# EAGLE design morse_lora_v2 (EAGLE 9.6.2)
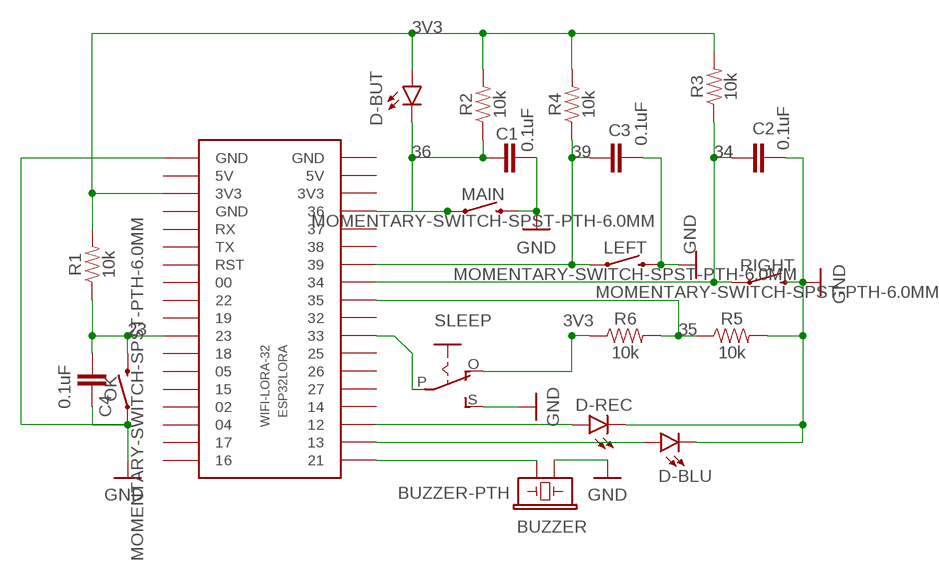
[diagram p0: schematic, sheet 1]

## Parts
BUZZER  BUZZER-PTH  [BUZZER-12MM]
C1  0.1uF  0.1UF-KIT-EZ-50V-20%  [CAP-PTH-SMALL-KIT]
C2  0.1uF  0.1UF-KIT-EZ-50V-20%  [CAP-PTH-SMALL-KIT]
C3  0.1uF  0.1UF-KIT-EZ-50V-20%  [CAP-PTH-SMALL-KIT]
C4  0.1uF  0.1UF-KIT-EZ-50V-20%  [CAP-PTH-SMALL-KIT]
D-BLU  LED5MM  [LED_5MM]
D-BUT  LED5MM  [LED_5MM]
D-REC  LED5MM  [LED_5MM]
ESP32LORA  WIFI-LORA-32  [2.54MM_2X18]
LEFT  MOMENTARY-SWITCH-SPST-PTH-6.0MM  [TACTILE_SWITCH_PTH_6.0MM]
MAIN  MOMENTARY-SWITCH-SPST-PTH-6.0MM  [TACTILE_SWITCH_PTH_6.0MM]
OK  MOMENTARY-SWITCH-SPST-PTH-6.0MM  [TACTILE_SWITCH_PTH_6.0MM]
R1  10k  10KOHM-HORIZ_KIT-1/4W-1%  [AXIAL-0.3-KIT]
R2  10k  10KOHM-HORIZ_KIT-1/4W-1%  [AXIAL-0.3-KIT]
R3  10k  10KOHM-HORIZ_KIT-1/4W-1%  [AXIAL-0.3-KIT]
R4  10k  10KOHM-HORIZ_KIT-1/4W-1%  [AXIAL-0.3-KIT]
R5  10k  10KOHM-HORIZ_KIT-1/4W-1%  [AXIAL-0.3-KIT]
R6  10k  10KOHM-HORIZ_KIT-1/4W-1%  [AXIAL-0.3-KIT]
RIGHT  MOMENTARY-SWITCH-SPST-PTH-6.0MM  [TACTILE_SWITCH_PTH_6.0MM]
SLEEP  EG1218S  [EG1218]

## Nets
3V3: D-BUT.A ESP32LORA.P$3(3V3) R1.P$2 R2.P$2 R3.P$2 R4.P$2 R6.P$1 SLEEP.O
23: C4.2 ESP32LORA.P$11 OK.3 R1.P$1
34: C2.2 ESP32LORA.P$29 R3.P$1 RIGHT.1
35: ESP32LORA.P$28 R5.P$1 R6.P$2
36: C1.2 D-BUT.K(C) ESP32LORA.P$33 MAIN.1 R2.P$1
39: C3.1 ESP32LORA.P$30 LEFT.1 R4.P$1
GND: BUZZER.- C1.1 C2.1 C3.2 C4.1 D-BLU.K(C) D-REC.K(C) ESP32LORA.P$1(GND) LEFT.3 MAIN.3 OK.1 R5.P$2 RIGHT.3 SLEEP.S
N$4: BUZZER.+ ESP32LORA.P$19
N$5: D-REC.A ESP32LORA.P$21
N$6: D-BLU.A ESP32LORA.P$20
N$13: ESP32LORA.P$26 SLEEP.P
Unconnected: ESP32LORA.P$2(5V) ESP32LORA.P$4(GND) ESP32LORA.P$5(RX) ESP32LORA.P$6(TX) ESP32LORA.P$7(RST) ESP32LORA.P$8 ESP32LORA.P$9 ESP32LORA.P$10 ESP32LORA.P$12 ESP32LORA.P$13 ESP32LORA.P$14 ESP32LORA.P$15 ESP32LORA.P$16 ESP32LORA.P$17 ESP32LORA.P$18 ESP32LORA.P$22 ESP32LORA.P$23 ESP32LORA.P$24 ESP32LORA.P$25 ESP32LORA.P$27 ESP32LORA.P$31 ESP32LORA.P$32 ESP32LORA.P$34(3V3) ESP32LORA.P$35(5V) ESP32LORA.P$36(GND)

## Library data of the parts
BUZZER = SparkFun-Electromechanical:BUZZER: Buzzer Small round buzzers that operate around the audible 2kHz range. You can use these as speakers to create simple music or user interfaces. Variant Overview: PTH - Mini Speaker - PC Mount 12mm 2.048kHz <https://www.sparkfun.com/products/7950> PTH_KIT - Mini Speaker - PC Mount 12mm 2.048kHz <https://www.sparkfun.com/products/7950> KIT simplifies soldering by adding stop mask to one side of the pads. PTH_NO_SILK - Mini Speaker - PC Mount 12mm 2.048kHz <https://www.sparkfun.com/products/7950> No silkscreen indicator of buzzer outline. PTH_KIT_NO_SILK - Mini Speaker - PC Mount 12mm 2.048kHz <https://www.sparkfun.com/products/7950> KIT package w/o silkscreen SMD - Buzzer Audio Magnetic (CCV-084B16) SMD buzzer used on, e.g. the LilyPad Buzzer <https://www.sparkfun.com/products/8463> and RFID USB Reader <https://www.sparkfun.com/products/9963>. SMD_KIT - Buzzer Audio Magnetic (CCV-084B16) SMD Buzzer with elongated pins to make soldering easier. Used on the SparkFun Simon Says - Surface Mount Soldering Kit <https://www.sparkfun.com/products/10935>.; PROD_ID: COMP-08253; SF_SKU: COM-07950
C1-C4 = SparkFun-Capacitors:0.1UF: 0.1µF ceramic capacitors A capacitor is a passive two-terminal electrical component used to store electrical energy temporarily in an electric field.; PROD_ID: CAP-08370
D-BLU D-BUT D-REC = SparkFun-LED:LED: LED (Generic) Standard schematic elements and footprints for 5mm, 3mm, 1206, and 0603 sized LEDs. Generic LEDs with no color specified.
ESP32LORA = ESP32_modules:WIFI-LORA-32
LEFT MAIN OK RIGHT = SparkFun-Switches:MOMENTARY-SWITCH-SPST: Momentary Switch (Pushbutton) - SPST Normally-open (NO) SPST momentary switches (buttons, pushbuttons). Variants PTH-12MM - 12mm square, through-hole Momentary Pushbutton Switch - 12mm Square <https://www.sparkfun.com/products/9190> (COM-09190) PTH-6.0MM, PTH-6.0MM-KIT - 6.0mm square, through-hole Mini Pushbutton Switch <https://www.sparkfun.com/products/97> (COM-00097) KIT package intended for soldering kit's - only one side of pads' copper is exposed. PTH-RIGHT-ANGLE-KIT - Right-angle, through-hole Right Angle Tactile Button <https://www.sparkfun.com/products/10791> - Used on SparkFun BigTime Watch Kit <https://www.sparkfun.com/products/11734> SMD-12MM - 12mm square, surface-mount Tactile Button - SMD (12mm) <https://www.sparkfun.com/products/12993> (COM-12993) Used on SparkFun PicoBoard <https://www.sparkfun.com/products/11888> SMD-4.5MM - 4.5mm Square Trackball Switch Used on SparkFun Blackberry Trackballer Breakout <https://www.sparkfun.com/products/13169> SMD-4.6MMX2.8MM - 4.60mm x 2.80mm, surface mount Used on SparkFun SAMD21 Mini Breakout <https://www.sparkfun.com/products/13664> SMD-5.2MM, SMD-5.2-REDUNDANT - 5.2mm square, surface-mount Mini Pushbutton Switch - SMD <https://www.sparkfun.com/products/8720> (COM-08720) Used on Arduino Pro Mini <https://www.sparkfun.com/products/11114> REDUNDANT package connects both switch circuits together SMD-6.0X3.5MM - 6.0 x 3.5mm, surface mount Momentary Reset Switch SMD <https://www.sparkfun.com/products/8229> (COM-08229) SMD-6.2MM-TALL - 6.2mm square, surface mount Tactile Button - SMD (6mm) <https://www.sparkfun.com/products/12992> Used on SparkFun Digital Sandbox <https://www.sparkfun.com/products/12651> SMD-RIGHT-ANGLE - Right-angle, surface mount Used on SparkFun Block for Intel® Edison - Arduino <https://www.sparkfun.com/products/13036>; PROD_ID: SWCH-08441; SF_SKU: COM-00097
R1-R6 = SparkFun-Resistors:10KOHM: 10kΩ resistor A resistor is a passive two-terminal electrical component that implements electrical resistance as a circuit element. Resistors act to reduce current flow, and, at the same time, act to lower voltage levels within circuits. - Wikipedia; PROD_ID: RES-12183
SLEEP = adafruit:EG1218: SLIDING SWITCH 0.1" spacing through hole, vertical SPDT slide switch http://www.ladyada.net/library/pcb/eaglelibrary.html

## Board
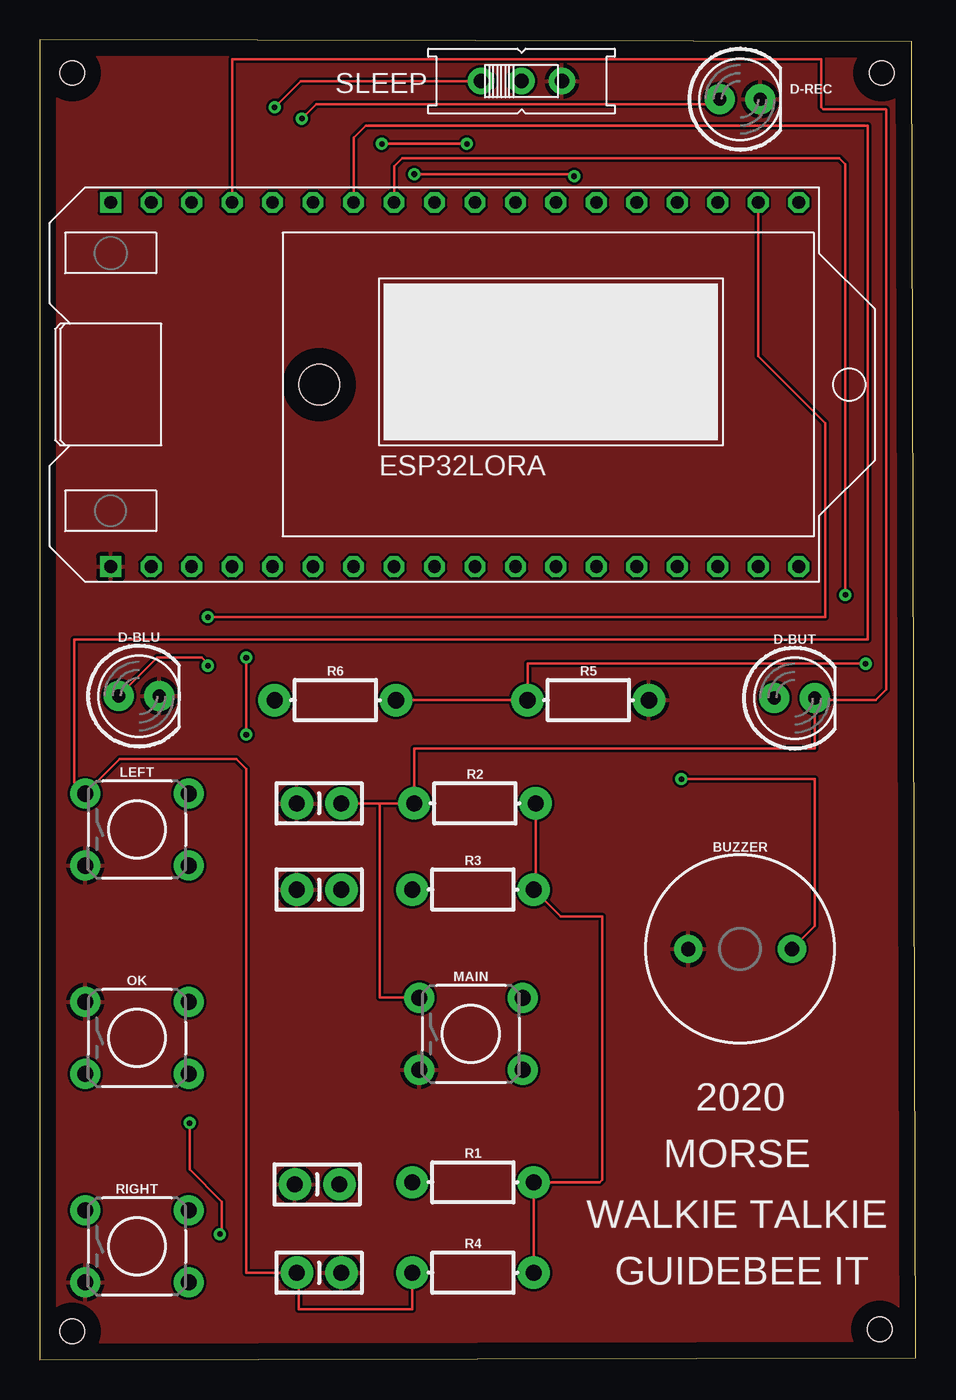
[diagram p1: board, top side]
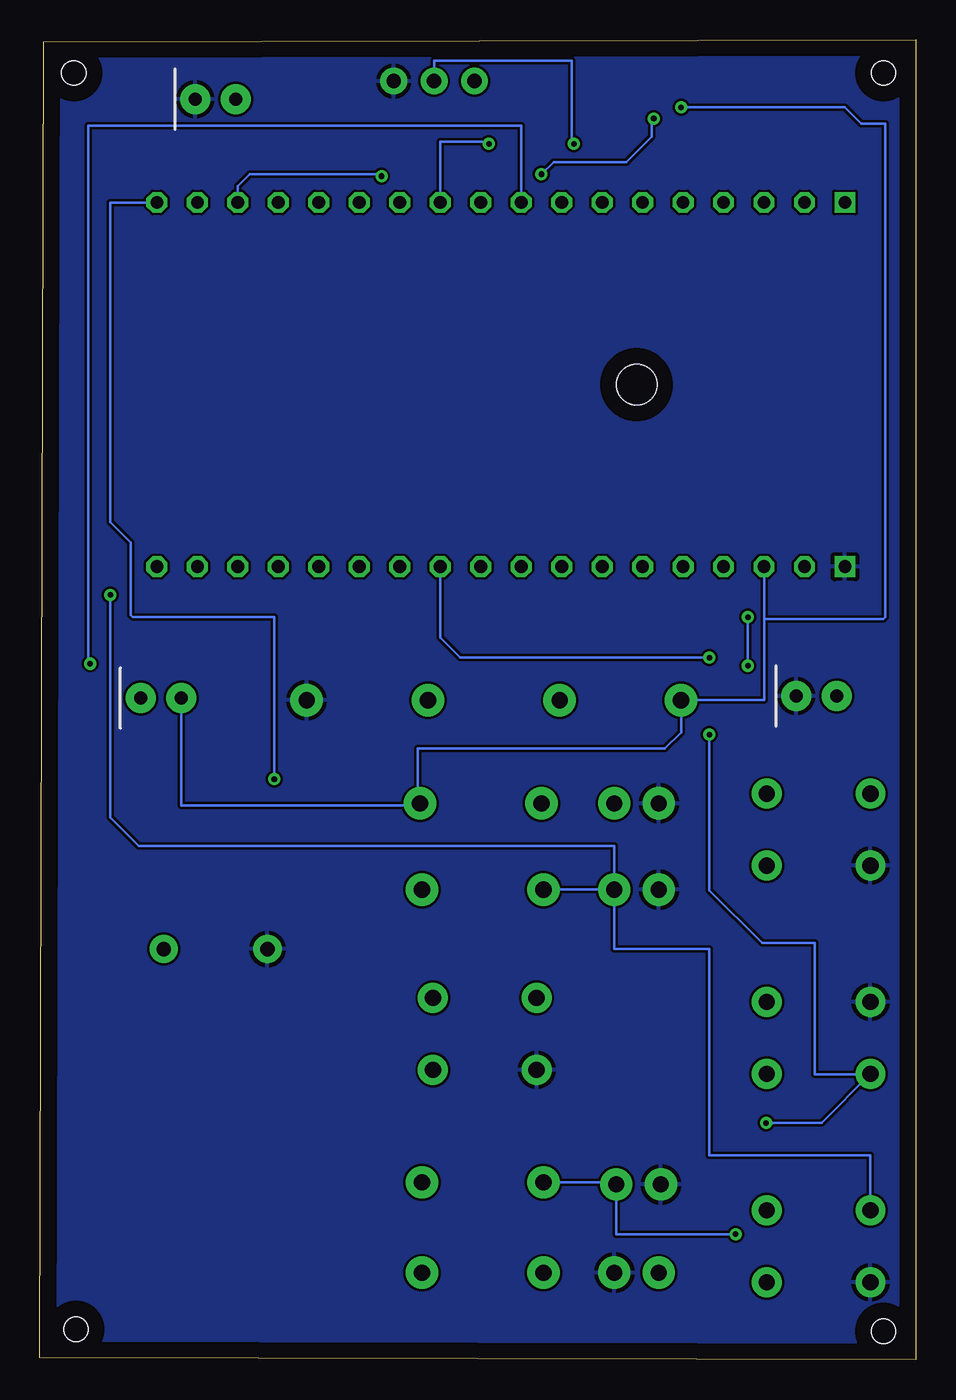
[diagram p2: board, bottom side, seen from below]

Size 54.97 x 82.86 mm. Coordinates in mm from the lower left corner, seen from the top.
Outline: 0,0 54.97,0.13 54.72,82.73 0,82.86 0,0
Copper layers (1*16): Top 0.035mm / dielectric 1.5mm / Bottom 0.035mm
Design rules "default": minimum track width 6mil, minimum drill 0.35mm, track to track 6mil, track to pad 6mil, pad to pad 6mil, via to via 6mil, smd to smd 6mil, copper to edge 40mil, drill to drill 6mil, minimum pad ring 10mil, minimum via ring 8mil, stop-mask expansion 4mil, vias tented up to drill 0mil, thermal gap 10mil
Holes 1.52 mm at 2.03,80.77 52.83,80.77 52.7,1.9 2.03,1.78
Holes 2.54 mm at 17.53,61.21

### Footprints (pad centres in the part's own frame; a part is rotated, then mirrored left to right if it is on the bottom)
BUZZER-12MM = drill 0.9 pad 1.778: + 3.25,0; - -3.25,0
CAP-PTH-SMALL-KIT = drill 1.016 pad 2.032: 1 -1.397,0; 2 1.397,0
LED_5MM = drill 0.813 pad 1.88: A -1.27,0; K 1.27,0
2.54MM_2X18 = drill 0.8 square: P$1 -20.32,-11.43; P$36 -20.32,11.43 | drill 0.8 octagon: P$2 -17.78,-11.43; P$3 -15.24,-11.43; P$4 -12.7,-11.43; P$5 -10.16,-11.43; P$6 -7.62,-11.43; P$7 -5.08,-11.43; P$8 -2.54,-11.43; P$9 0,-11.43; P$10 2.54,-11.43; P$11 5.08,-11.43; P$12 7.62,-11.43; P$13 10.16,-11.43; P$14 12.7,-11.43; P$15 15.24,-11.43; P$16 17.78,-11.43; P$17 20.32,-11.43; P$18 22.86,-11.43; P$19 22.86,11.43; P$20 20.32,11.43; P$21 17.78,11.43; P$22 15.24,11.43; P$23 12.7,11.43; P$24 10.16,11.43; P$25 7.62,11.43; P$26 5.08,11.43; P$27 2.54,11.43; P$28 0,11.43; P$29 -2.54,11.43; P$30 -5.08,11.43; P$31 -7.62,11.43; P$32 -10.16,11.43; P$33 -12.7,11.43; P$34 -15.24,11.43; P$35 -17.78,11.43
TACTILE_SWITCH_PTH_6.0MM = drill 1.016 pad 1.88: 1 -3.251,2.261; 2 3.251,2.261; 3 -3.251,-2.261; 4 3.251,-2.261
AXIAL-0.3-KIT = drill 1.016 pad 2.032: P$1 -3.81,0; P$2 3.81,0
EG1218 = drill 0.9 pad 1.676: O -2.54,0; P 0,0; S 2.54,0

### Placement (x,y rotation side)
BUZZER  43.94,25.78 0 top
C1  17.53,34.92 0 top
C2  17.53,29.51 0 top
C3  17.53,5.46 0 top
C4  17.4,11.01 0 top
D-BLU  6.22,41.66 0 top
D-BUT  47.37,41.53 0 top
D-REC  43.94,79.12 0 top
ESP32LORA  24.77,61.21 0 top
LEFT  6.1,33.27 0 top
MAIN  27.05,20.45 0 top
OK  6.1,20.19 0 top
R1  27.18,11.13 0 top
R2  27.31,34.92 0 top
R3  27.18,29.51 0 top
R4  27.18,5.46 0 top
R5  34.42,41.4 0 top
R6  18.54,41.4 0 top
RIGHT  6.1,7.11 0 top
SLEEP  30.23,80.26 0 top

### Tracks (layer width: path | path; a pad name or v marks a point on that pad's centre or on a via)
3V3  (via drill 0.35)
  Top 0.152: SLEEP.O 16.38,80.26 v14.73,78.61 | R2.P$2 31.12,29.63 R3.P$2 32.68,27.81 35.31,27.81 35.31,11.3 35.14,11.13 R1.P$2 R4.P$2
  Bottom 0.152: v14.73,78.61 4.45,78.61 3.43,77.6 1.91,77.6 1.91,46.61 2.03,46.48 9.53,46.48 ESP32LORA.P$3 9.53,41.4 R6.P$1 14.73,39.37 15.75,38.35 31.24,38.35 31.24,35.05 R2.P$2 31.24,34.8 46.1,34.8 D-BUT.A
23  (via drill 0.35)
  Top 0.152: v12.95,44.07 v12.95,39.24 | v9.4,14.86 9.4,11.94 11.43,9.91 11.43,8 v11.3,7.87
  Bottom 0.152: ESP32LORA.P$11 29.85,45.34 28.58,44.07 v12.95,44.07 | v12.95,39.24 12.95,29.46 9.65,26.16 6.35,26.16 6.35,17.91 2.87,17.91 OK.3 5.92,14.86 v9.4,14.86 | v11.3,7.87 18.8,7.87 C4.2 18.92,11.13 R1.P$1
34  (via drill 0.35)
  Top 0.152: ESP32LORA.P$29 22.23,74.93 22.73,75.44 50.16,75.44 50.55,75.06 v50.55,48.01
  Bottom 0.152: v50.55,48.01 50.55,34.04 48.77,32.26 18.92,32.26 C2.2 | C2.2 R3.P$1 | C2.2 18.92,25.78 12.95,25.78 12.95,12.83 2.84,12.83 RIGHT.1
35  (via drill 0.35)
  Top 0.152: v51.82,43.69 30.61,43.69 R5.P$1 R6.P$2
  Bottom 0.152: ESP32LORA.P$28 24.77,77.47 51.94,77.47 51.94,43.81 v51.82,43.69
36
  Top 0.152: R2.P$1 23.5,38.35 48.64,38.35 D-BUT.K 48.77,41.4 52.45,41.4 53.12,42.07 53.12,78.45 53.09,78.49 49.15,78.49 49.02,78.61 49.02,81.64 12.06,81.64 ESP32LORA.P$33 | R2.P$1 C1.2 | R2.P$1 | R2.P$1 21.34,34.92 21.34,22.73 23.77,22.73 MAIN.1
39
  Top 0.152: ESP32LORA.P$30 19.69,76.71 20.45,77.47 51.94,77.47 51.94,45.21 2.16,45.21 2.16,36.22 LEFT.1 5.03,37.72 12.32,37.72 12.95,37.08 12.95,5.46 C3.1 16.26,5.33 16.26,3.17 23.37,3.17 R4.P$1
GND
  pour Top: 54.48,-0.25 54.48,82.55 0.38,82.55 0.38,0.38 53.85,0.38
  pour Bottom: 54.36,0.38 0.38,0.38 0.38,82.55 54.36,82.55
N$4  (via drill 0.35)
  Top 0.152: v40.26,36.45 48.64,36.45 48.64,27.23 BUZZER.+
  Bottom 0.152: ESP32LORA.P$19 50.55,72.64 50.55,52.58 49.28,51.31 49.28,46.74 49.15,46.61 40.26,46.61 v40.26,36.45
N$5  (via drill 0.35)
  Top 0.152: v33.53,74.3 33.4,74.42 v23.5,74.42 | v16.45,77.91 17.34,78.8 42.35,78.8 D-REC.A
  Bottom 0.152: ESP32LORA.P$21 42.54,73.66 41.78,74.42 33.66,74.42 v33.53,74.3 | v23.5,74.42 22.73,75.18 18.16,75.18 16.57,76.77 16.57,77.79 v16.45,77.91
N$6  (via drill 0.35)
  Top 0.152: ESP32LORA.P$20 45.09,62.99 49.28,58.8 49.28,46.61 v10.54,46.61 | v10.54,43.56 10.54,43.69 10.16,44.07 7.37,44.07 D-BLU.A
  Bottom 0.152: v10.54,46.61 v10.54,43.56
N$13  (via drill 0.35)
  Top 0.152: v26.8,76.33 v21.46,76.33
  Bottom 0.152: ESP32LORA.P$26 29.85,76.45 26.8,76.45 v26.8,76.33 | v21.46,76.33 21.59,76.45 21.59,81.53 30.23,81.53 SLEEP.P

### Text on the board
tNames: 2020 | MORSE | WALKIE TALKIE | GUIDEBEE IT